# Altium schematic sheet Speed Controller.SchDoc
size A4
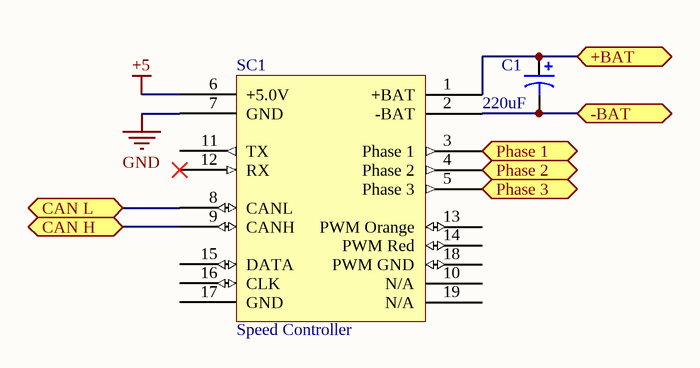
[diagram p0: Speed Controller.SchDoc]

## Parts
C1  value 220uF  [220uf radial Capacitor]  (hidden comment: Cap Pol1)
SC1  Speed Controller  [Autoquad-esc32-speed-controller]

## Ports
+BAT, -BAT, CAN H, CAN L, Phase 1 (out), Phase 2 (out), Phase 3 (out)

## Nets
+5: SC1.6(+5.0V)
GND: SC1.7(GND)
+BAT: C1.1 SC1.1(+BAT) ; port +BAT
-BAT: C1.2 SC1.2(-BAT) ; port -BAT
CAN H: SC1.9(CANH) ; port CAN H
CAN L: SC1.8(CANL) ; port CAN L
Phase 1: SC1.3(Phase_1) ; port Phase 1
Phase 2: SC1.4(Phase_2) ; port Phase 2
Phase 3: SC1.5(Phase_3) ; port Phase 3

Not connected (* = marked no-connect by the designer): SC1 10(N/A) 11(TX) 12(RX)* 13(PWM_Orange) 14(PWM_Red) 15(DATA) 16(CLK) 17(GND) 18(PWM_GND) 19(N/A)

## Library data of the parts
C1 = Cap Pol1: Polarized Capacitor (Radial); Published: 8-Jun-2000; LatestRevisionDate: 17-Jul-2002; LatestRevisionNote: Re-released for DXP Platform.; PackageReference: RB7.6-15; Publisher: Altium Limited; farnell: 8126569
SC1 = Speed Controller: Autoquad ESC32 Speed Controller